# Altium schematic sheet Bluetooth_might_crash_altium.SchDoc
size A4
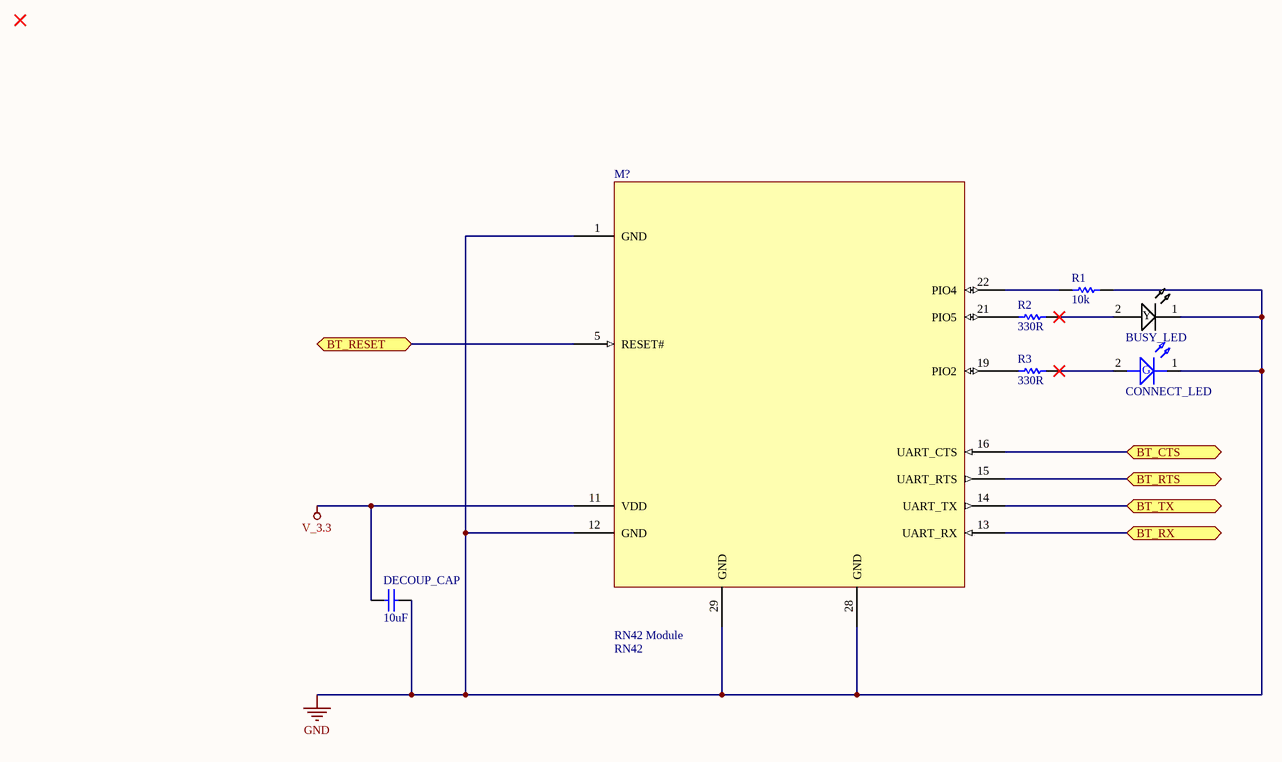
[diagram p0: Bluetooth_might_crash_altium.SchDoc]

## Parts
BUSY_LED  DL_Dialight_YELLOW_rightangle  [G_Dialight_One-level_3mm]  (value not drawn)
CONNECT_LED  DL_Dialight_GREEN_rightangle  [G_Dialight_One-level_3mm]  (value not drawn)
DECOUP_CAP  10uF  [0805]
M?  RN42 Module  value RN42  [RN42-LAND]  (no BOM)
R1  10k  [0603]
R2  330R  [0603]
R3  330R  [0603]

## Ports
BT_CTS, BT_RESET, BT_RTS, BT_RX, BT_TX

## Nets
GND: BUSY_LED.1(C) CONNECT_LED.1(C) DECOUP_CAP.2 M?.1(GND) M?.12(GND) M?.28(GND) M?.29(GND) R1.2
V_3.3: DECOUP_CAP.1 M?.11(VDD)
BT_CTS: M?.16(UART_CTS) ; port BT_CTS
BT_RESET: M?.5(RESET#) ; port BT_RESET
BT_RTS: M?.15(UART_RTS) ; port BT_RTS
BT_RX: M?.13(UART_RX) ; port BT_RX
BT_TX: M?.14(UART_TX) ; port BT_TX
NetBUSY_LED_2: BUSY_LED.2(A) R2.2
NetCONNECT_LED_2: CONNECT_LED.2(A) R3.2
NetM?_19: M?.19(PIO2) R3.1
NetM?_21: M?.21(PIO5) R2.1
NetM?_22: M?.22(PIO4) R1.1

Not connected (* = marked no-connect by the designer): M? 2(SPI_MOSI) 3(PIO6) 4(PIO7) 6(SPI_SCK) 7(PCM_CLK) 8(PCM_SYNC) 9(PCM_IN) 10(PCM_OUT) 17(USB_D+) 18(USB_D-) 20(PIO3) 23(SPI_CS#) 24(SPI_MISO) 30(AIO0) 31(PIO8) 32(PIO9) 33(PIO10) 34(PIO11) 35(AIO1)

## Notes on the sheet
- (in symbol DL_Dialight_GREEN_rightangle) G
- (in symbol DL_Dialight_YELLOW_rightangle) Y

## Library data of the parts
BUSY_LED = DL_Dialight_YELLOW_rightangle: LED 3MM RT ANG HI EFF YEL PC MNT; Manufacturer PN: 551-0309F; Manufacturer: Dialight; Supplier_Component_Code: 350-1667-ND; Supplier_Name: Digikey; Supplier 1: Digi-Key; Supplier Part Number 1: 350-1667-ND
CONNECT_LED = DL_Dialight_GREEN_rightangle: LED 3MM RT ANG HI EFF GRN PC MNT; Manufacturer PN: 551-0209; Manufacturer: Dialight; Supplier_Component_Code: 350-1665-ND; Supplier_Name: Digikey; Supplier 1: Digi-Key; Supplier Part Number 1: 350-1665-ND
DECOUP_CAP = CP_10uF 0805: CAP 10uF 10% 10V X5R 0805; Manufacturer: Murata; Manufacturer PN: GRM219R61A106KE44D; LatestRevisionDate: 29 May 08; Supplier_Component_Code: 490-4735-1-ND; Supplier_Name: Digikey; Supplier 1: Digi-Key; Supplier Part Number 1: 490-4735-1-ND; Value: 10uF
M? = RN42MOD
R1 = RS_10k 0603: RES 10.0K OHM 1/10W 1% 0603 SMD; Manufacturer: Yageo; Manufacturer PN: RC0603FR-0710KL; LatestRevisionDate: 29 May 08; Supplier_Name: Digikey; Supplier 1: Digi-Key; Supplier Part Number 1: 311-10.0KHRTR-ND; Value: 10k
R2 R3 = RS_330R 0603: RES 330 OHM 1/10W 1% 0603 SMD; Manufacturer: Yageo; Manufacturer PN: RC0603FR-07330RL; LatestRevisionDate: 25 June 2009; Supplier_Name: Digikey; Supplier 1: Digi-Key; Supplier Part Number 1: 311-330HRTR-ND; Value: 330R